# Altium schematic sheet User_Interface.SchDoc: User Interface
size A3; DocumentNumber: 12; SheetNumber: 13; SheetTotal: 20
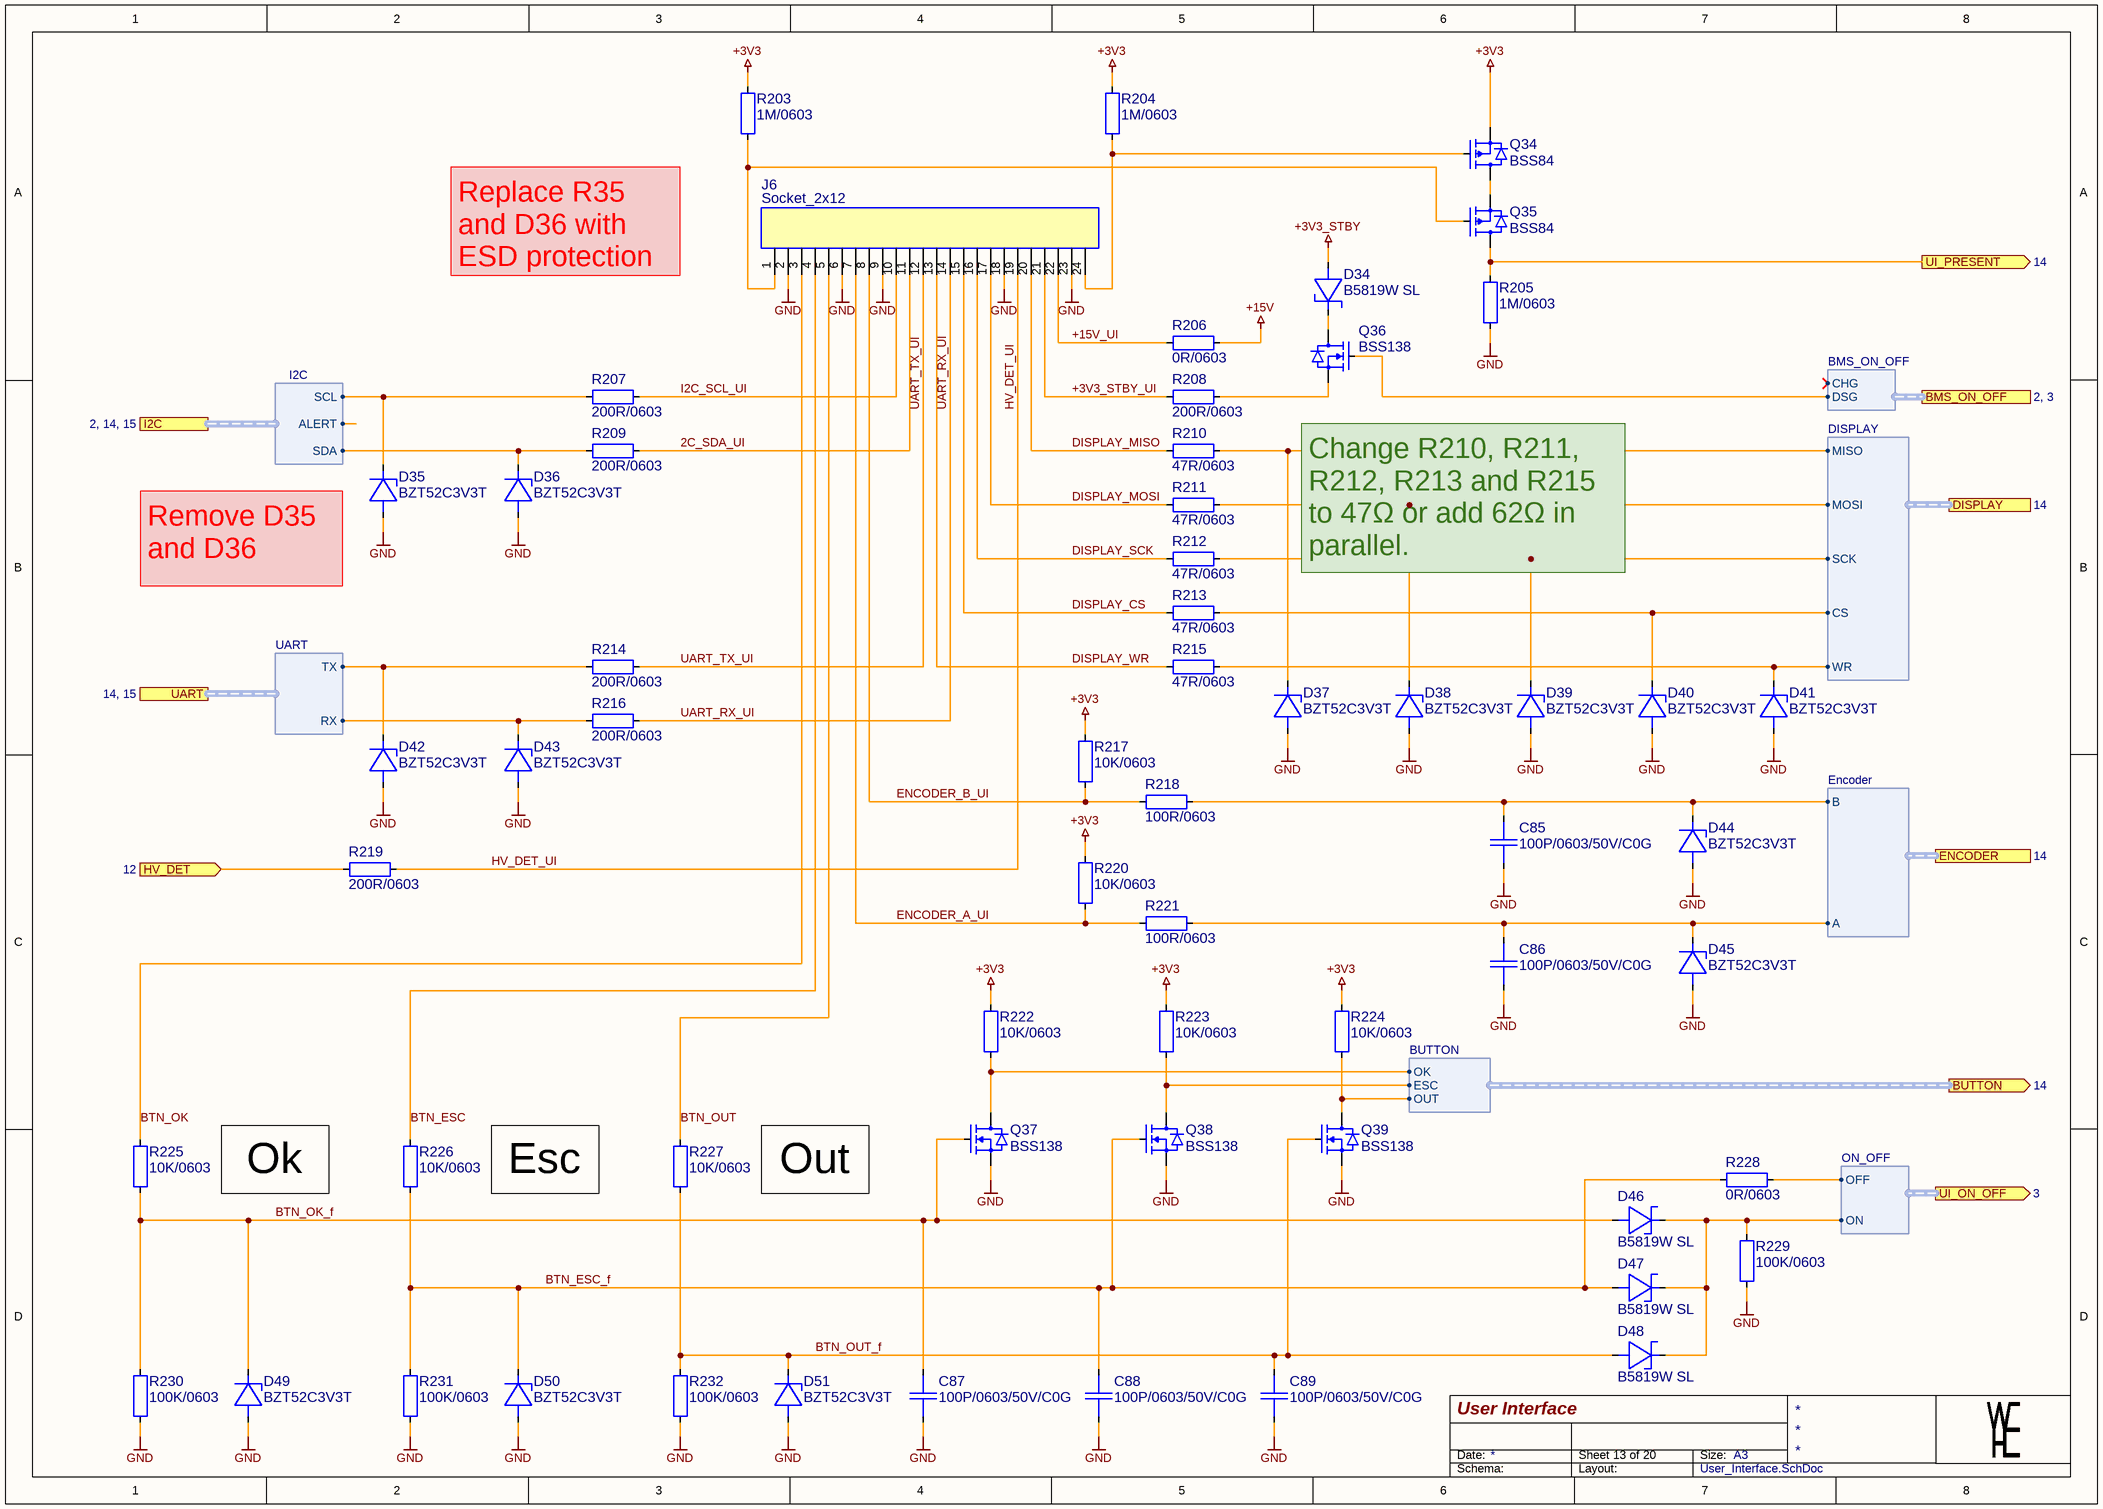
[diagram p0: User_Interface.SchDoc]

## Parts
C85  100P/0603/50V/C0G  [CAP0603_C0G]
C86  100P/0603/50V/C0G  [CAP0603_C0G]
C87  100P/0603/50V/C0G  [CAP0603_C0G]
C88  100P/0603/50V/C0G  [CAP0603_C0G]
C89  100P/0603/50V/C0G  [CAP0603_C0G]
D34  B5819W SL  [SOD3718X125]
D35  BZT52C3V3T  [SOD1608X065]
D36  BZT52C3V3T  [SOD1608X065]
D37  BZT52C3V3T  [SOD1608X065]
D38  BZT52C3V3T  [SOD1608X065]
D39  BZT52C3V3T  [SOD1608X065]
D40  BZT52C3V3T  [SOD1608X065]
D41  BZT52C3V3T  [SOD1608X065]
D42  BZT52C3V3T  [SOD1608X065]
D43  BZT52C3V3T  [SOD1608X065]
D44  BZT52C3V3T  [SOD1608X065]
D45  BZT52C3V3T  [SOD1608X065]
D46  B5819W SL  [SOD3718X125]
D47  B5819W SL  [SOD3718X125]
D48  B5819W SL  [SOD3718X125]
D49  BZT52C3V3T  [SOD1608X065]
D50  BZT52C3V3T  [SOD1608X065]
D51  BZT52C3V3T  [SOD1608X065]
J6  Socket_2x12  [SOCK_254_2X12_700]
Q34  BSS84  [SOT2395P280X125-3-SE]
Q35  BSS84  [SOT2395P280X125-3-SE]
Q36  BSS138  [SOT2395P280X125-3-SE]
Q37  BSS138  [SOT2395P280X125-3-SE]
Q38  BSS138  [SOT2395P280X125-3-SE]
Q39  BSS138  [SOT2395P280X125-3-SE]
R203  1M/0603  [R0603-0.40-WW]
R204  1M/0603  [R0603-0.40-WW]
R205  1M/0603  [R0603-0.40-WW]
R206  0R/0603  [R0603-0.40-WW]
R207  200R/0603  [R0603-0.40-WW]
R208  200R/0603  [R0603-0.40-WW]
R209  200R/0603  [R0603-0.40-WW]
R210  47R/0603  [R0603-0.40-WW]
R211  47R/0603  [R0603-0.40-WW]
R212  47R/0603  [R0603-0.40-WW]
R213  47R/0603  [R0603-0.40-WW]
R214  200R/0603  [R0603-0.40-WW]
R215  47R/0603  [R0603-0.40-WW]
R216  200R/0603  [R0603-0.40-WW]
R217  10K/0603  [R0603-0.40-WW]
R218  100R/0603  [R0603-0.40-WW]
R219  200R/0603  [R0603-0.40-WW]
R220  10K/0603  [R0603-0.40-WW]
R221  100R/0603  [R0603-0.40-WW]
R222  10K/0603  [R0603-0.40-WW]
R223  10K/0603  [R0603-0.40-WW]
R224  10K/0603  [R0603-0.40-WW]
R225  10K/0603  [R0603-0.40-WW]
R226  10K/0603  [R0603-0.40-WW]
R227  10K/0603  [R0603-0.40-WW]
R228  0R/0603  [R0603-0.40-WW]
R229  100K/0603  [R0603-0.40-WW]
R230  100K/0603  [R0603-0.40-WW]
R231  100K/0603  [R0603-0.40-WW]
R232  100K/0603  [R0603-0.40-WW]

## Ports
BMS_ON_OFF (harness BMS_ON_OFF, see 2, 3), BUTTON (out, harness BUTTON, see 14), DISPLAY (harness DISPLAY, see 14), ENCODER (harness Encoder, see 14), HV_DET (in, see 12), I2C (harness I2C, see 2, 14, 15), UART (harness UART, see 14, 15), UI_ON_OFF (out, harness ON_OFF, see 3), UI_PRESENT (out, see 14)

## Harnesses
Encoder: A, B
BUTTON: OK, ESC, OUT
I2C: ALERT, SCL, SDA
UART: TX, RX
ON_OFF: OFF, ON
DISPLAY: MISO, MOSI, SCK, CS, WR
BMS_ON_OFF: CHG, DSG

## Nets
+3V3: Q34.2(SOURCE) R203.1 R204.1 R217.1 R220.1 R222.1 R223.1 R224.1
+3V3_STBY: D34.2(A)
+15V: R206.2
GND: C85.2 C86.2 C87.2 C88.2 C89.2 D35.2(A) D36.2(A) D37.2(A) D38.2(A) D39.2(A) D40.2(A) D41.2(A) D42.2(A) D43.2(A) D44.2(A) D45.2(A) D49.2(A) D50.2(A) D51.2(A) J6.2 J6.6 J6.9 J6.18 J6.23 Q37.2(SOURCE) Q38.2(SOURCE) Q39.2(SOURCE) R205.2 R229.2 R230.2 R231.2 R232.2
2C_SDA_UI: J6.11 R209.2
+3V3_STBY_UI: J6.21 R208.2
+15V_UI: J6.22 R206.1
BTN_ESC: J6.4 R226.1
BTN_ESC_f: C88.1 D47.2(A) D50.1(C) Q38.1(GATE) R226.2 R228.1 R231.1
BTN_OK: J6.3 R225.1
BTN_OK_f: C87.1 D46.2(A) D49.1(C) Q37.1(GATE) R225.2 R230.1
BTN_OUT: J6.5 R227.1
BTN_OUT_f: C89.1 D48.2(A) D51.1(C) Q39.1(GATE) R227.2 R232.1
DISPLAY_CS: J6.15 R213.1
DISPLAY_MISO: J6.20 R210.1
DISPLAY_MOSI: J6.17 R211.1
DISPLAY_SCK: J6.16 R212.1
DISPLAY_WR: J6.13 R215.1
ENCODER_A_UI: J6.7 R220.2 R221.1
ENCODER_B_UI: J6.8 R217.2 R218.1
HV_DET: R219.1 ; port HV_DET
HV_DET_UI: J6.19 R219.2
I2C_SCL_UI: J6.10 R207.2
UART_RX_UI: J6.14 R216.2
UART_TX_UI: J6.12 R214.2
UI_PRESENT: Q35.3(DRAIN) R205.1 ; port UI_PRESENT
NetC85_1: C85.1 D44.1(C) R218.2 ; port ENCODER.B
NetC86_1: C86.1 D45.1(C) R221.2 ; port ENCODER.A
NetD34_1: D34.1(C) Q36.3(DRAIN)
NetD35_1: D35.1(C) R207.1 ; port I2C.SCL
NetD36_1: D36.1(C) R209.1 ; port I2C.SDA
NetD37_1: D37.1(C) R210.2 ; port DISPLAY.MISO
NetD38_1: D38.1(C) R211.2 ; port DISPLAY.MOSI
NetD39_1: D39.1(C) R212.2 ; port DISPLAY.SCK
NetD40_1: D40.1(C) R213.2 ; port DISPLAY.CS
NetD41_1: D41.1(C) R215.2 ; port DISPLAY.WR
NetD42_1: D42.1(C) R214.1 ; port UART.TX
NetD43_1: D43.1(C) R216.1 ; port UART.RX
NetD46_1: D46.1(C) D47.1(C) D48.1(C) R229.1 ; port UI_ON_OFF.ON
NetJ6_1: J6.1 Q35.1(GATE) R203.2
NetJ6_24: J6.24 Q34.1(GATE) R204.2
NetQ34_3: Q34.3(DRAIN) Q35.2(SOURCE)
NetQ36_1: Q36.1(GATE) ; port BMS_ON_OFF.DSG
NetQ36_2: Q36.2(SOURCE) R208.1
NetQ37_3: Q37.3(DRAIN) R222.2 ; port BUTTON.OK
NetQ38_3: Q38.3(DRAIN) R223.2 ; port BUTTON.ESC
NetQ39_3: Q39.3(DRAIN) R224.2 ; port BUTTON.OUT
NetR228_2: R228.2 ; port UI_ON_OFF.OFF

## Notes on the sheet
- Replace R35 and D36 with ESD protection
- (near D35) Remove D35 and D36
- Change R210, R211, R212, R213 and R215 to 47Ω or add 62Ω in parallel.
- Ok
- Esc
- Out
- Date:
- Size:
- A3
- Schema:
- Layout:

## Library data of the parts
C85-C89 = 100P/0603/50V/C0G: CAP SM 0603 100pF 50V C0G; Manufacturer: GENERIC; Manufacturer 1: YAGEO; Manufacturer Part Number 1: CC0603JRNPO9BN101; Absolute Value: 1E-10; Eurocircuits GPN: GPC0603101-C0G; Part Number: 100P/0603/50V/C0G; Package: 0603; Value: 100pF; HelpURL: https://www.yageo.com/upload/media/product/productsearch/datasheet/mlcc/UPY-GP_NP0_16V-to-50V_18.pdf; Supplier 1: Digi-Key; Supplier Part Number 1: 311-1069-1-ND; Manufacturer 2: YAGEO; Manufacturer Part Number 2: CC0603KRNPO9BN101; Supplier 2: Digi-Key; Supplier Part Number 2: 311-3600-1-ND; JLC Type: Basic; Manufacturer Part Number 3: CL10C101JB8NNNC; Supplier 3: LCSC; Supplier Part Number 3: C14858
D34 D46-D48 = B5819W SL: 40V 600mV@1A 1A SOD-123 Schottky Barrier Diodes; Manufacturer: GENERIC; Manufacturer 1: SMC Diode Solutions; Part Number: B5819W SL; Package: SOD-123; Value: B5819W SL; Absolute Value: 40V; HelpURL: https://datasheet.lcsc.com/lcsc/2304140030_Jiangsu-Changjing-Electronics-Technology-Co---Ltd--B5819W-SL_C8598.pdf; Manufacturer Part Number 1: B5819WSL; Supplier 1: Digikey; Supplier Part Number 1: 1655-B5819WSLCT-ND; Manufacturer 3: Jiangsu Changjing Electronics Technology Co., Ltd.; Manufacturer Part Number 3: B5819W SL; Supplier 3: LCSC; Supplier Part Number 3: C8598; JLC Type: Basic
D35-D45 D49-D51 = BZT52C3V3T: DIODE ZENER 3.3V 300MW SOD523; Manufacturer: Diodes Incorporated; Manufacturer Part Number 1: BZT52C3V3T-7; Part Number: BZT52C3V3T; Package: SC-79, SOD-523; Value: BZT52C3V3T; Absolute Value: 3.3 V; HelpURL: https://www.diodes.com/assets/Datasheets/ds30502.pdf; Manufacturer 1: Diodes Incorporated; Supplier 1: Digikey; Supplier Part Number 1: BZT52C3V3T-7DICT-ND; Manufacturer 2: Micro Commercial Co; Manufacturer Part Number 2: BZT52C3V3T-TP; Supplier 2: Digikey; Supplier Part Number 2: BZT52C3V3T-TPMSCT-ND; Manufacturer 3: BORN; Manufacturer Part Number 3: BZT52C3V3T; Supplier 3: LCSC; Supplier Part Number 3: C20612286
J6 = Socket_2x12_7mm: Socket 2.100mil 2x12, height 7mm; Manufacturer: GENERIC; Manufacturer 1: Preci-Dip; Manufacturer Part Number 1: 803-87-024-10-001101; System: Connector; Part Number: Socket_2x12_7mm; Supplier 1: Digi-Key; Supplier Part Number 1: 1212-1252-ND
Q34 Q35 = BSS84: 50V P-Channel MOSFET; Manufacturer: GENERIC; Manufacturer 1: Good-Ark Semiconductor; Part Number: BSS84; Package: SOT23; HelpURL: https://goodarksemi.com/docs/datasheets/mosfets/BSS84.pdf; Manufacturer Part Number 1: BSS84; Supplier 1: Digi-Key; Supplier Part Number 1: 4786-BSS84CT-ND; Manufacturer 3: Jiangsu Changjing Electronics Technology Co., Ltd.; Manufacturer Part Number 3: BSS84; Supplier 3: LCSC; Supplier Part Number 3: C114481; JLC Type: Extended; Manufacturer 2: LRC; Manufacturer Part Number 2: LBSS84LT1G; Supplier 2: LCSC; Supplier Part Number 2: C8492
Q36-Q39 = BSS138: N-Kanal 50 V 220mA (Ta) 350mW (Ta) Oberflächenmontage SOT-23; Manufacturer: GENERIC; Manufacturer 1: ANBON SEMICONDUCTOR (INT'L) LIMITED; Part Number: BSS138; Package: SOT23; HelpURL: https://mm.digikey.com/Volume0/opasdata/d220001/medias/docus/3037/BSS138.pdf; Manufacturer Part Number 1: BSS138; Supplier 1: Digi-Key; Supplier Part Number 1: 4530-BSS138CT-ND; Manufacturer 3: FOSAN; Manufacturer Part Number 3: BSS138; Supplier 3: LCSC; Supplier Part Number 3: C2926186; JLC Type: Extended; Manufacturer 2: FOSAN; Manufacturer Part Number 2: BSS138; Supplier 2: LCSC; Supplier Part Number 2: C2926186
R203-R205 = 1M/0603: RES SM 0603 1M; Manufacturer: GENERIC; Manufacturer 1: YAGEO; Manufacturer Part Number 1: RC0603FR-131ML; Absolute Value: 1000000; Eurocircuits GPN: GPR06031M; Part Number: 1M/0603; Package: 0603; Value: 1M; HelpURL: https://www.yageogroup.com/content/datasheet/asset/file/PYU-RC_GROUP_51_ROHS_L; Supplier 1: Digi-Key; Supplier Part Number 1: 13-RC0603FR-131MLCT-ND; Manufacturer 2: YAGEO; Manufacturer Part Number 2: RC0603FR-101ML; Supplier 2: Digi-Key; Supplier Part Number 2: 13-RC0603FR-101MLCT-ND; Manufacturer 3: UNI-ROYAL(Uniroyal Elec); Manufacturer Part Number 3: 0603WAF1004T5E; Supplier 3: LCSC; Supplier Part Number 3: C22935; JLC Type: Basic
R206 R228 = 0R/0603: RES SM 0603 0R; Manufacturer: GENERIC; Manufacturer 1: YAGEO; Manufacturer Part Number 1: RC0603FR-070RL; Absolute Value: 0; Eurocircuits GPN: GPR06030R; Part Number: 0R/0603; Package: 0603; Value: 0R; HelpURL: https://www.yageogroup.com/content/datasheet/asset/file/PYU-RC_GROUP_51_ROHS_L; Supplier 1: Digi-Key; Supplier Part Number 1: 311-0.0HRCT-ND; Manufacturer 2: YAGEO; Manufacturer Part Number 2: RC0603FR-130RL; Supplier 2: Digi-Key; Supplier Part Number 2: 13-RC0603FR-130RLCT-ND; Manufacturer 3: UNI-ROYAL(Uniroyal Elec); Manufacturer Part Number 3: 0603WAF0000T5E; Supplier 3: LCSC; Supplier Part Number 3: C21189; JLC Type: Basic
R207-R209 R214 R216 R219 = 200R/0603: RES SM 0603 200R; Manufacturer: GENERIC; Manufacturer 1: YAGEO; Manufacturer Part Number 1: RC0603FR-13200RL; Absolute Value: 200; Eurocircuits GPN: GPR0603200R; Part Number: 200R/0603; Package: 0603; Value: 200R; HelpURL: https://www.yageogroup.com/content/datasheet/asset/file/PYU-RC_GROUP_51_ROHS_L; Supplier 1: Digi-Key; Supplier Part Number 1: 13-RC0603FR-13200RLCT-ND; Manufacturer 2: YAGEO; Manufacturer Part Number 2: RC0603FR-07200RL; Supplier 2: Digi-Key; Supplier Part Number 2: 311-200HRCT-ND; JLC Type: Basic; Manufacturer 3: UNI-ROYAL(Uniroyal Elec); Manufacturer Part Number 3: 0603WAF2000T5E; Supplier 3: LCSC; Supplier Part Number 3: C8218
R210-R213 R215 = 47R/0603: RES SM 0603 47R; Manufacturer: GENERIC; Manufacturer 1: YAGEO; Manufacturer Part Number 1: RC0603FR-1347RL; Absolute Value: 47; Eurocircuits GPN: GPR060347R; Part Number: 47R/0603; Package: 0603; Value: 47R; HelpURL: https://www.yageogroup.com/content/datasheet/asset/file/PYU-RC_GROUP_51_ROHS_L; Supplier 1: Digi-Key; Supplier Part Number 1: 13-RC0603FR-1347RLCT-ND; Manufacturer 2: YAGEO; Manufacturer Part Number 2: RC0603FR-1047RL; Supplier 2: Digi-Key; Supplier Part Number 2: 13-RC0603FR-1047RLCT-ND
R217 R220 R222-R227 = 10K/0603: RES SM 0603 10K; Manufacturer: GENERIC; Manufacturer 1: YAGEO; Manufacturer Part Number 1: RC0603FR-1310KL; Absolute Value: 10000; Eurocircuits GPN: GPR060310K; Part Number: 10K/0603; Package: 0603; Value: 10K; HelpURL: https://www.yageogroup.com/content/datasheet/asset/file/PYU-RC_GROUP_51_ROHS_L; Supplier 1: Digi-Key; Supplier Part Number 1: 13-RC0603FR-1310KLCT-ND; Manufacturer 2: YAGEO; Manufacturer Part Number 2: RC0603FR-1010KL; Supplier 2: Digi-Key; Supplier Part Number 2: 13-RC0603FR-1010KLCT-ND; Manufacturer 3: UNI-ROYAL(Uniroyal Elec); Manufacturer Part Number 3: 0603WAF1002T5E; Supplier 3: LCSC; Supplier Part Number 3: C25804; JLC Type: Basic
R218 R221 = 100R/0603: RES SM 0603 100R; Manufacturer: GENERIC; Manufacturer 1: YAGEO; Manufacturer Part Number 1: RC0603FR-13100RL; Absolute Value: 100; Eurocircuits GPN: GPR0603100R; Part Number: 100R/0603; Package: 0603; Value: 100R; HelpURL: https://www.yageogroup.com/content/datasheet/asset/file/PYU-RC_GROUP_51_ROHS_L; Supplier 1: Digi-Key; Supplier Part Number 1: 13-RC0603FR-13100RLCT-ND; Manufacturer 2: YAGEO; Manufacturer Part Number 2: RC0603FR-10100RL; Supplier 2: Digi-Key; Supplier Part Number 2: 13-RC0603FR-10100RLCT-ND; Manufacturer 3: UNI-ROYAL(Uniroyal Elec); Manufacturer Part Number 3: 0603WAF1000T5E; Supplier 3: LCSC; Supplier Part Number 3: C22775
R229-R232 = 100K/0603: RES SM 0603 100K; Manufacturer: GENERIC; Manufacturer 1: YAGEO; Manufacturer Part Number 1: RC0603FR-13100KL; Absolute Value: 100000; Eurocircuits GPN: GPR0603100K; Part Number: 100K/0603; Package: 0603; Value: 100K; HelpURL: https://www.yageogroup.com/content/datasheet/asset/file/PYU-RC_GROUP_51_ROHS_L; Supplier 1: Digi-Key; Supplier Part Number 1: 13-RC0603FR-13100KLCT-ND; Manufacturer 2: YAGEO; Manufacturer Part Number 2: RC0603FR-10100KL; Supplier 2: Digi-Key; Supplier Part Number 2: 13-RC0603FR-10100KLCT-ND; Manufacturer 3: UNI-ROYAL(Uniroyal Elec); Manufacturer Part Number 3: 0603WAF1003T5E; Supplier 3: LCSC; Supplier Part Number 3: C25803; JLC Type: Basic